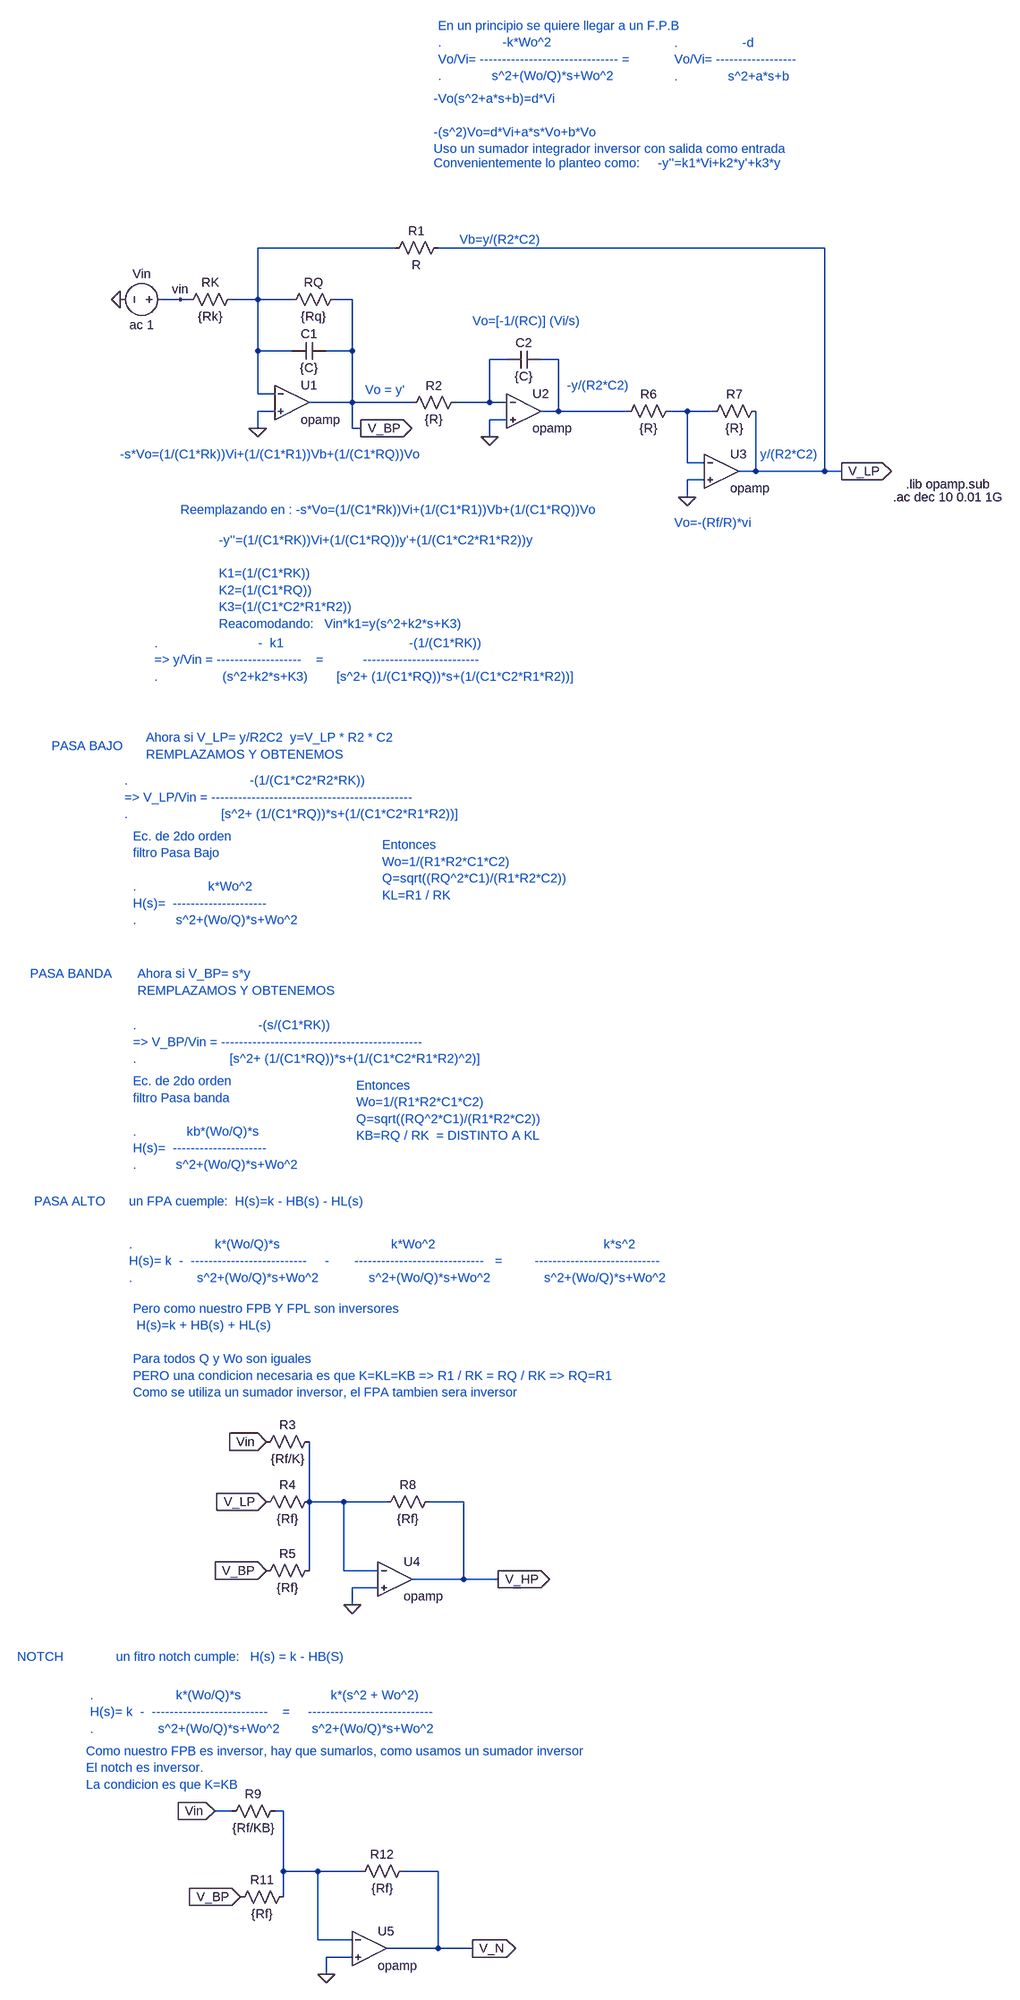
[diagram p0: schematic bicuad-inversor.asc]
bicuad-inversor.asc, the LTspice schematic file:
Version 4
SHEET 1 1600 3304
WIRE 320 64 64 64
WIRE 1120 64 400 64
WIRE -80 160 -112 160
WIRE -64 160 -80 160
WIRE 64 160 64 64
WIRE 64 160 16 160
WIRE 128 160 64 160
WIRE 240 160 208 160
WIRE 64 256 64 160
WIRE 128 256 64 256
WIRE 240 256 240 160
WIRE 240 256 192 256
WIRE 528 272 496 272
WIRE 624 272 592 272
WIRE 64 336 64 256
WIRE 96 336 64 336
WIRE 240 352 240 256
WIRE 240 352 160 352
WIRE 352 352 240 352
WIRE 496 352 496 272
WIRE 496 352 432 352
WIRE 528 352 496 352
WIRE 96 368 64 368
WIRE 624 368 624 272
WIRE 624 368 592 368
WIRE 752 368 624 368
WIRE 864 368 832 368
WIRE 912 368 864 368
WIRE 528 384 496 384
WIRE 64 400 64 368
WIRE 240 400 240 352
WIRE 256 400 240 400
WIRE 496 416 496 384
WIRE 864 464 864 368
WIRE 896 464 864 464
WIRE 992 480 992 368
WIRE 992 480 960 480
WIRE 1120 480 1120 64
WIRE 1120 480 992 480
WIRE 1152 480 1120 480
WIRE 896 496 864 496
WIRE 864 528 864 496
WIRE 160 2400 160 2288
WIRE 224 2400 160 2400
WIRE 304 2400 224 2400
WIRE 448 2400 384 2400
WIRE 160 2528 160 2400
WIRE 224 2528 224 2400
WIRE 288 2528 224 2528
WIRE 448 2544 448 2400
WIRE 448 2544 352 2544
WIRE 512 2544 448 2544
WIRE 288 2560 240 2560
WIRE 240 2592 240 2560
WIRE 16 2976 -16 2976
WIRE 112 2976 96 2976
WIRE 112 3088 112 2976
WIRE 176 3088 112 3088
WIRE 256 3088 176 3088
WIRE 400 3088 336 3088
WIRE 112 3136 112 3088
WIRE 176 3216 176 3088
WIRE 240 3216 176 3216
WIRE 400 3232 400 3088
WIRE 400 3232 304 3232
WIRE 464 3232 400 3232
WIRE 240 3248 192 3248
WIRE 192 3280 192 3248
FLAG 64 400 0
FLAG -192 160 0
FLAG 496 416 0
FLAG 864 528 0
FLAG 1152 480 V_LP
IOPIN 1152 480 Out
FLAG 256 400 V_BP
IOPIN 256 400 Out
FLAG -80 160 vin
FLAG 80 2288 Vin
IOPIN 80 2288 In
FLAG 80 2400 V_LP
IOPIN 80 2400 In
FLAG 80 2528 V_BP
IOPIN 80 2528 In
FLAG 240 2592 0
FLAG 512 2544 V_HP
IOPIN 512 2544 Out
FLAG -16 2976 Vin
IOPIN -16 2976 In
FLAG 32 3136 V_BP
IOPIN 32 3136 In
FLAG 192 3280 0
FLAG 464 3232 V_N
IOPIN 464 3232 Out
SYMBOL res 32 144 R90
WINDOW 0 0 56 VBottom 2
WINDOW 3 32 56 VTop 2
SYMATTR InstName RK
SYMATTR Value {Rk}
SYMBOL res 224 144 R90
WINDOW 0 0 56 VBottom 2
WINDOW 3 32 56 VTop 2
SYMATTR InstName RQ
SYMATTR Value {Rq}
SYMBOL OpAmps\\opamp 128 288 R0
SYMATTR InstName U1
SYMBOL voltage -96 160 R90
WINDOW 0 -32 56 VBottom 2
WINDOW 3 32 56 VTop 2
WINDOW 123 0 0 Left 0
WINDOW 39 0 0 Left 0
SYMATTR InstName Vin
SYMATTR Value ac 1
SYMBOL cap 192 240 R90
WINDOW 0 0 32 VBottom 2
WINDOW 3 32 32 VTop 2
SYMATTR InstName C1
SYMATTR Value {C}
SYMBOL OpAmps\\opamp 560 304 R0
SYMATTR InstName U2
SYMBOL cap 592 256 R90
WINDOW 0 0 32 VBottom 2
WINDOW 3 32 32 VTop 2
SYMATTR InstName C2
SYMATTR Value {C}
SYMBOL res 448 336 R90
WINDOW 0 0 56 VBottom 2
WINDOW 3 32 56 VTop 2
SYMATTR InstName R2
SYMATTR Value {R}
SYMBOL res 848 352 R90
WINDOW 0 0 56 VBottom 2
WINDOW 3 32 56 VTop 2
SYMATTR InstName R6
SYMATTR Value {R}
SYMBOL res 1008 352 R90
WINDOW 0 0 56 VBottom 2
WINDOW 3 32 56 VTop 2
SYMATTR InstName R7
SYMATTR Value {R}
SYMBOL OpAmps\\opamp 928 416 R0
SYMATTR InstName U3
SYMBOL res 416 48 R90
WINDOW 0 0 56 VBottom 2
WINDOW 3 32 56 VTop 2
SYMATTR InstName R1
SYMBOL res 176 2272 R90
WINDOW 0 0 56 VBottom 2
WINDOW 3 32 56 VTop 2
SYMATTR InstName R3
SYMATTR Value {Rf/K}
SYMBOL res 176 2384 R90
WINDOW 0 0 56 VBottom 2
WINDOW 3 32 56 VTop 2
SYMATTR InstName R4
SYMATTR Value {Rf}
SYMBOL res 176 2512 R90
WINDOW 0 0 56 VBottom 2
WINDOW 3 32 56 VTop 2
SYMATTR InstName R5
SYMATTR Value {Rf}
SYMBOL res 400 2384 R90
WINDOW 0 0 56 VBottom 2
WINDOW 3 32 56 VTop 2
SYMATTR InstName R8
SYMATTR Value {Rf}
SYMBOL OpAmps\\opamp 320 2480 R0
SYMATTR InstName U4
SYMBOL res 112 2960 R90
WINDOW 0 0 56 VBottom 2
WINDOW 3 32 56 VTop 2
SYMATTR InstName R9
SYMATTR Value {Rf/KB}
SYMBOL res 128 3120 R90
WINDOW 0 0 56 VBottom 2
WINDOW 3 32 56 VTop 2
SYMATTR InstName R11
SYMATTR Value {Rf}
SYMBOL res 352 3072 R90
WINDOW 0 0 56 VBottom 2
WINDOW 3 32 56 VTop 2
SYMATTR InstName R12
SYMATTR Value {Rf}
SYMBOL OpAmps\\opamp 272 3168 R0
SYMATTR InstName U5
TEXT 464 200 Left 2 ;Vo=[-1/(RC)] (Vi/s)
TEXT 1272 504 Left 2 !.lib opamp.sub
TEXT 1248 528 Left 2 !.ac dec 10 0.01 1G
TEXT 840 576 Left 2 ;Vo=-(Rf/R)*vi
TEXT 400 -352 Left 2 ;En un principio se quiere llegar a un F.P.B\n.                 -k*Wo^2\nVo/Vi= ------------------------------- =\n.              s^2+(Wo/Q)*s+Wo^2
TEXT 392 -96 Left 2 ;Convenientemente lo planteo como:     -y''=k1*Vi+k2*y'+k3*y
TEXT 264 328 Left 2 ;Vo = y'
TEXT -192 448 Left 2 ;-s*Vo=(1/(C1*Rk))Vi+(1/(C1*R1))Vb+(1/(C1*RQ))Vo
TEXT 640 320 Left 2 ;-y/(R2*C2)
TEXT 1000 448 Left 2 ;y/(R2*C2)
TEXT 440 48 Left 2 ;Vb=y/(R2*C2)
TEXT -80 552 Left 2 ;Reemplazando en : -s*Vo=(1/(C1*Rk))Vi+(1/(C1*R1))Vb+(1/(C1*RQ))Vo
TEXT -8 608 Left 2 ;-y''=(1/(C1*RK))Vi+(1/(C1*RQ))y'+(1/(C1*C2*R1*R2))y\n \nK1=(1/(C1*RK))\nK2=(1/(C1*RQ))\nK3=(1/(C1*C2*R1*R2))\nReacomodando:   Vin*k1=y(s^2+k2*s+K3)
TEXT -144 976 Left 2 ;Ahora si V_LP= y/R2C2  y=V_LP * R2 * C2\nREMPLAZAMOS Y OBTENEMOS
TEXT -184 1056 Left 2 ;.                                  -(1/(C1*C2*R2*RK))\n=> V_LP/Vin = ---------------------------------------------\n.                          [s^2+ (1/(C1*RQ))*s+(1/(C1*C2*R1*R2))]
TEXT -168 1160 Left 2 ;Ec. de 2do orden \nfiltro Pasa Bajo\n \n.                    k*Wo^2\nH(s)=  ---------------------\n.           s^2+(Wo/Q)*s+Wo^2
TEXT 296 1176 Left 2 ;Entonces\nWo=1/(R1*R2*C1*C2)\nQ=sqrt((RQ^2*C1)/(R1*R2*C2))\nKL=R1 / RK
TEXT -160 1416 Left 2 ;Ahora si V_BP= s*y\nREMPLAZAMOS Y OBTENEMOS
TEXT -168 1512 Left 2 ;.                                  -(s/(C1*RK))\n=> V_BP/Vin = ---------------------------------------------\n.                          [s^2+ (1/(C1*RQ))*s+(1/(C1*C2*R1*R2)^2)]
TEXT -168 1616 Left 2 ;Ec. de 2do orden \nfiltro Pasa banda\n \n.              kb*(Wo/Q)*s\nH(s)=  ---------------------\n.           s^2+(Wo/Q)*s+Wo^2
TEXT 840 -320 Left 2 ;.                  -d\nVo/Vi= ------------------\n.              s^2+a*s+b
TEXT 392 -216 Left 2 ;-Vo(s^2+a*s+b)=d*Vi\n \n-(s^2)Vo=d*Vi+a*s*Vo+b*Vo \nUso un sumador integrador inversor con salida como entrada
TEXT -128 800 Left 2 ;.                            -  k1                                   -(1/(C1*RK))\n=> y/Vin = -------------------    =           --------------------------\n.                  (s^2+k2*s+K3)        [s^2+ (1/(C1*RQ))*s+(1/(C1*C2*R1*R2))]
TEXT -320 992 Left 2 ;PASA BAJO
TEXT -360 1416 Left 2 ;PASA BANDA
TEXT 248 1624 Left 2 ;Entonces\nWo=1/(R1*R2*C1*C2)\nQ=sqrt((RQ^2*C1)/(R1*R2*C2))\nKB=RQ / RK  = DISTINTO A KL
TEXT -352 1840 Left 2 ;PASA ALTO
TEXT -176 1840 Left 2 ;un FPA cuemple:  H(s)=k - HB(s) - HL(s)
TEXT -176 1920 Left 2 ;.                       k*(Wo/Q)*s                               k*Wo^2                                               k*s^2\nH(s)= k  -  --------------------------     -       -----------------------------   =         ----------------------------\n.                  s^2+(Wo/Q)*s+Wo^2              s^2+(Wo/Q)*s+Wo^2               s^2+(Wo/Q)*s+Wo^2
TEXT -168 2040 Left 2 ;Pero como nuestro FPB Y FPL son inversores\n H(s)=k + HB(s) + HL(s)\n \nPara todos Q y Wo son iguales \nPERO una condicion necesaria es que K=KL=KB => R1 / RK = RQ / RK => RQ=R1\nComo se utiliza un sumador inversor, el FPA tambien sera inversor
TEXT -384 2688 Left 2 ;NOTCH
TEXT -200 2688 Left 2 ;un fitro notch cumple:   H(s) = k - HB(S)
TEXT -248 2760 Left 2 ;.                       k*(Wo/Q)*s                         k*(s^2 + Wo^2)\nH(s)= k  -  --------------------------    =     ----------------------------\n.                  s^2+(Wo/Q)*s+Wo^2         s^2+(Wo/Q)*s+Wo^2
TEXT -256 2864 Left 2 ;Como nuestro FPB es inversor, hay que sumarlos, como usamos un sumador inversor\nEl notch es inversor.\nLa condicion es que K=KB

The netlist it stands for:
* bicuad-inversor.asc
RK N001 vin {Rk}
RQ V_BP N001 {Rq}
XU1 N001 0 V_BP opamp Aol=100K GBW=10Meg  ; pins invin noninvin out
Vin vin 0 ac 1
C1 V_BP N001 {C}
XU2 N002 0 N003 opamp Aol=100K GBW=10Meg  ; pins invin noninvin out
C2 N003 N002 {C}
R2 N002 V_BP {R}
R6 N004 N003 {R}
R7 V_LP N004 {R}
XU3 N004 0 V_LP opamp Aol=100K GBW=10Meg  ; pins invin noninvin out
R1 V_LP N001 R
R3 N005 vin {Rf/K}
R4 N005 V_LP {Rf}
R5 N005 V_BP {Rf}
R8 V_HP N005 {Rf}
XU4 N005 0 V_HP opamp Aol=100K GBW=10Meg  ; pins invin noninvin out
R9 N006 vin {Rf/KB}
R11 N006 V_BP {Rf}
R12 V_N N006 {Rf}
XU5 N006 0 V_N opamp Aol=100K GBW=10Meg  ; pins invin noninvin out
* Vo=[-1/(RC)] (Vi/s)
.lib opamp.sub
.ac dec 10 0.01 1G
* Vo=-(Rf/R)*vi
* En un principio se quiere llegar a un F.P.B
* .                 -k*Wo^2
* Vo/Vi= ------------------------------- =
* .              s^2+(Wo/Q)*s+Wo^2
* Convenientemente lo planteo como:     -y''=k1*Vi+k2*y'+k3*y
* Vo = y'
* -s*Vo=(1/(C1*Rk))Vi+(1/(C1*R1))Vb+(1/(C1*RQ))Vo
* -y/(R2*C2)
* y/(R2*C2)
* Vb=y/(R2*C2)
* Reemplazando en : -s*Vo=(1/(C1*Rk))Vi+(1/(C1*R1))Vb+(1/(C1*RQ))Vo
* -y''=(1/(C1*RK))Vi+(1/(C1*RQ))y'+(1/(C1*C2*R1*R2))y
* K1=(1/(C1*RK))
* K2=(1/(C1*RQ))
* K3=(1/(C1*C2*R1*R2))
* Reacomodando:   Vin*k1=y(s^2+k2*s+K3)
* Ahora si V_LP= y/R2C2  y=V_LP * R2 * C2
* REMPLAZAMOS Y OBTENEMOS
* .                                  -(1/(C1*C2*R2*RK))
* => V_LP/Vin = ---------------------------------------------
* .                          [s^2+ (1/(C1*RQ))*s+(1/(C1*C2*R1*R2))]
* Ec. de 2do orden
* filtro Pasa Bajo
* .                    k*Wo^2
* H(s)=  ---------------------
* .           s^2+(Wo/Q)*s+Wo^2
* Entonces
* Wo=1/(R1*R2*C1*C2)
* Q=sqrt((RQ^2*C1)/(R1*R2*C2))
* KL=R1 / RK
* Ahora si V_BP= s*y
* REMPLAZAMOS Y OBTENEMOS
* .                                  -(s/(C1*RK))
* => V_BP/Vin = ---------------------------------------------
* .                          [s^2+ (1/(C1*RQ))*s+(1/(C1*C2*R1*R2)^2)]
* Ec. de 2do orden
* filtro Pasa banda
* .              kb*(Wo/Q)*s
* H(s)=  ---------------------
* .           s^2+(Wo/Q)*s+Wo^2
* .                  -d
* Vo/Vi= ------------------
* .              s^2+a*s+b
* -Vo(s^2+a*s+b)=d*Vi
* -(s^2)Vo=d*Vi+a*s*Vo+b*Vo
* Uso un sumador integrador inversor con salida como entrada
* .                            -  k1                                   -(1/(C1*RK))
* => y/Vin = -------------------    =           --------------------------
* .                  (s^2+k2*s+K3)        [s^2+ (1/(C1*RQ))*s+(1/(C1*C2*R1*R2))]
* PASA BAJO
* PASA BANDA
* Entonces
* Wo=1/(R1*R2*C1*C2)
* Q=sqrt((RQ^2*C1)/(R1*R2*C2))
* KB=RQ / RK  = DISTINTO A KL
* PASA ALTO
* un FPA cuemple:  H(s)=k - HB(s) - HL(s)
* .                       k*(Wo/Q)*s                               k*Wo^2                                               k*s^2
* H(s)= k  -  --------------------------     -       -----------------------------   =         ----------------------------
* .                  s^2+(Wo/Q)*s+Wo^2              s^2+(Wo/Q)*s+Wo^2               s^2+(Wo/Q)*s+Wo^2
* Pero como nuestro FPB Y FPL son inversores
*  H(s)=k + HB(s) + HL(s)
* Para todos Q y Wo son iguales
* PERO una condicion necesaria es que K=KL=KB => R1 / RK = RQ / RK => RQ=R1
* Como se utiliza un sumador inversor, el FPA tambien sera inversor
* NOTCH
* un fitro notch cumple:   H(s) = k - HB(S)
* .                       k*(Wo/Q)*s                         k*(s^2 + Wo^2)
* H(s)= k  -  --------------------------    =     ----------------------------
* .                  s^2+(Wo/Q)*s+Wo^2         s^2+(Wo/Q)*s+Wo^2
* Como nuestro FPB es inversor, hay que sumarlos, como usamos un sumador inversor
* El notch es inversor.
* La condicion es que K=KB
.backanno
.end